# EasyEDA schematic SCH_Solder_2025-04-30.json
TITLE: Sheet_1; REV: 1.0; Date: 2025-04-27; Sheet: 1/1; Drawn By: adarsh2203; Company: Your Company
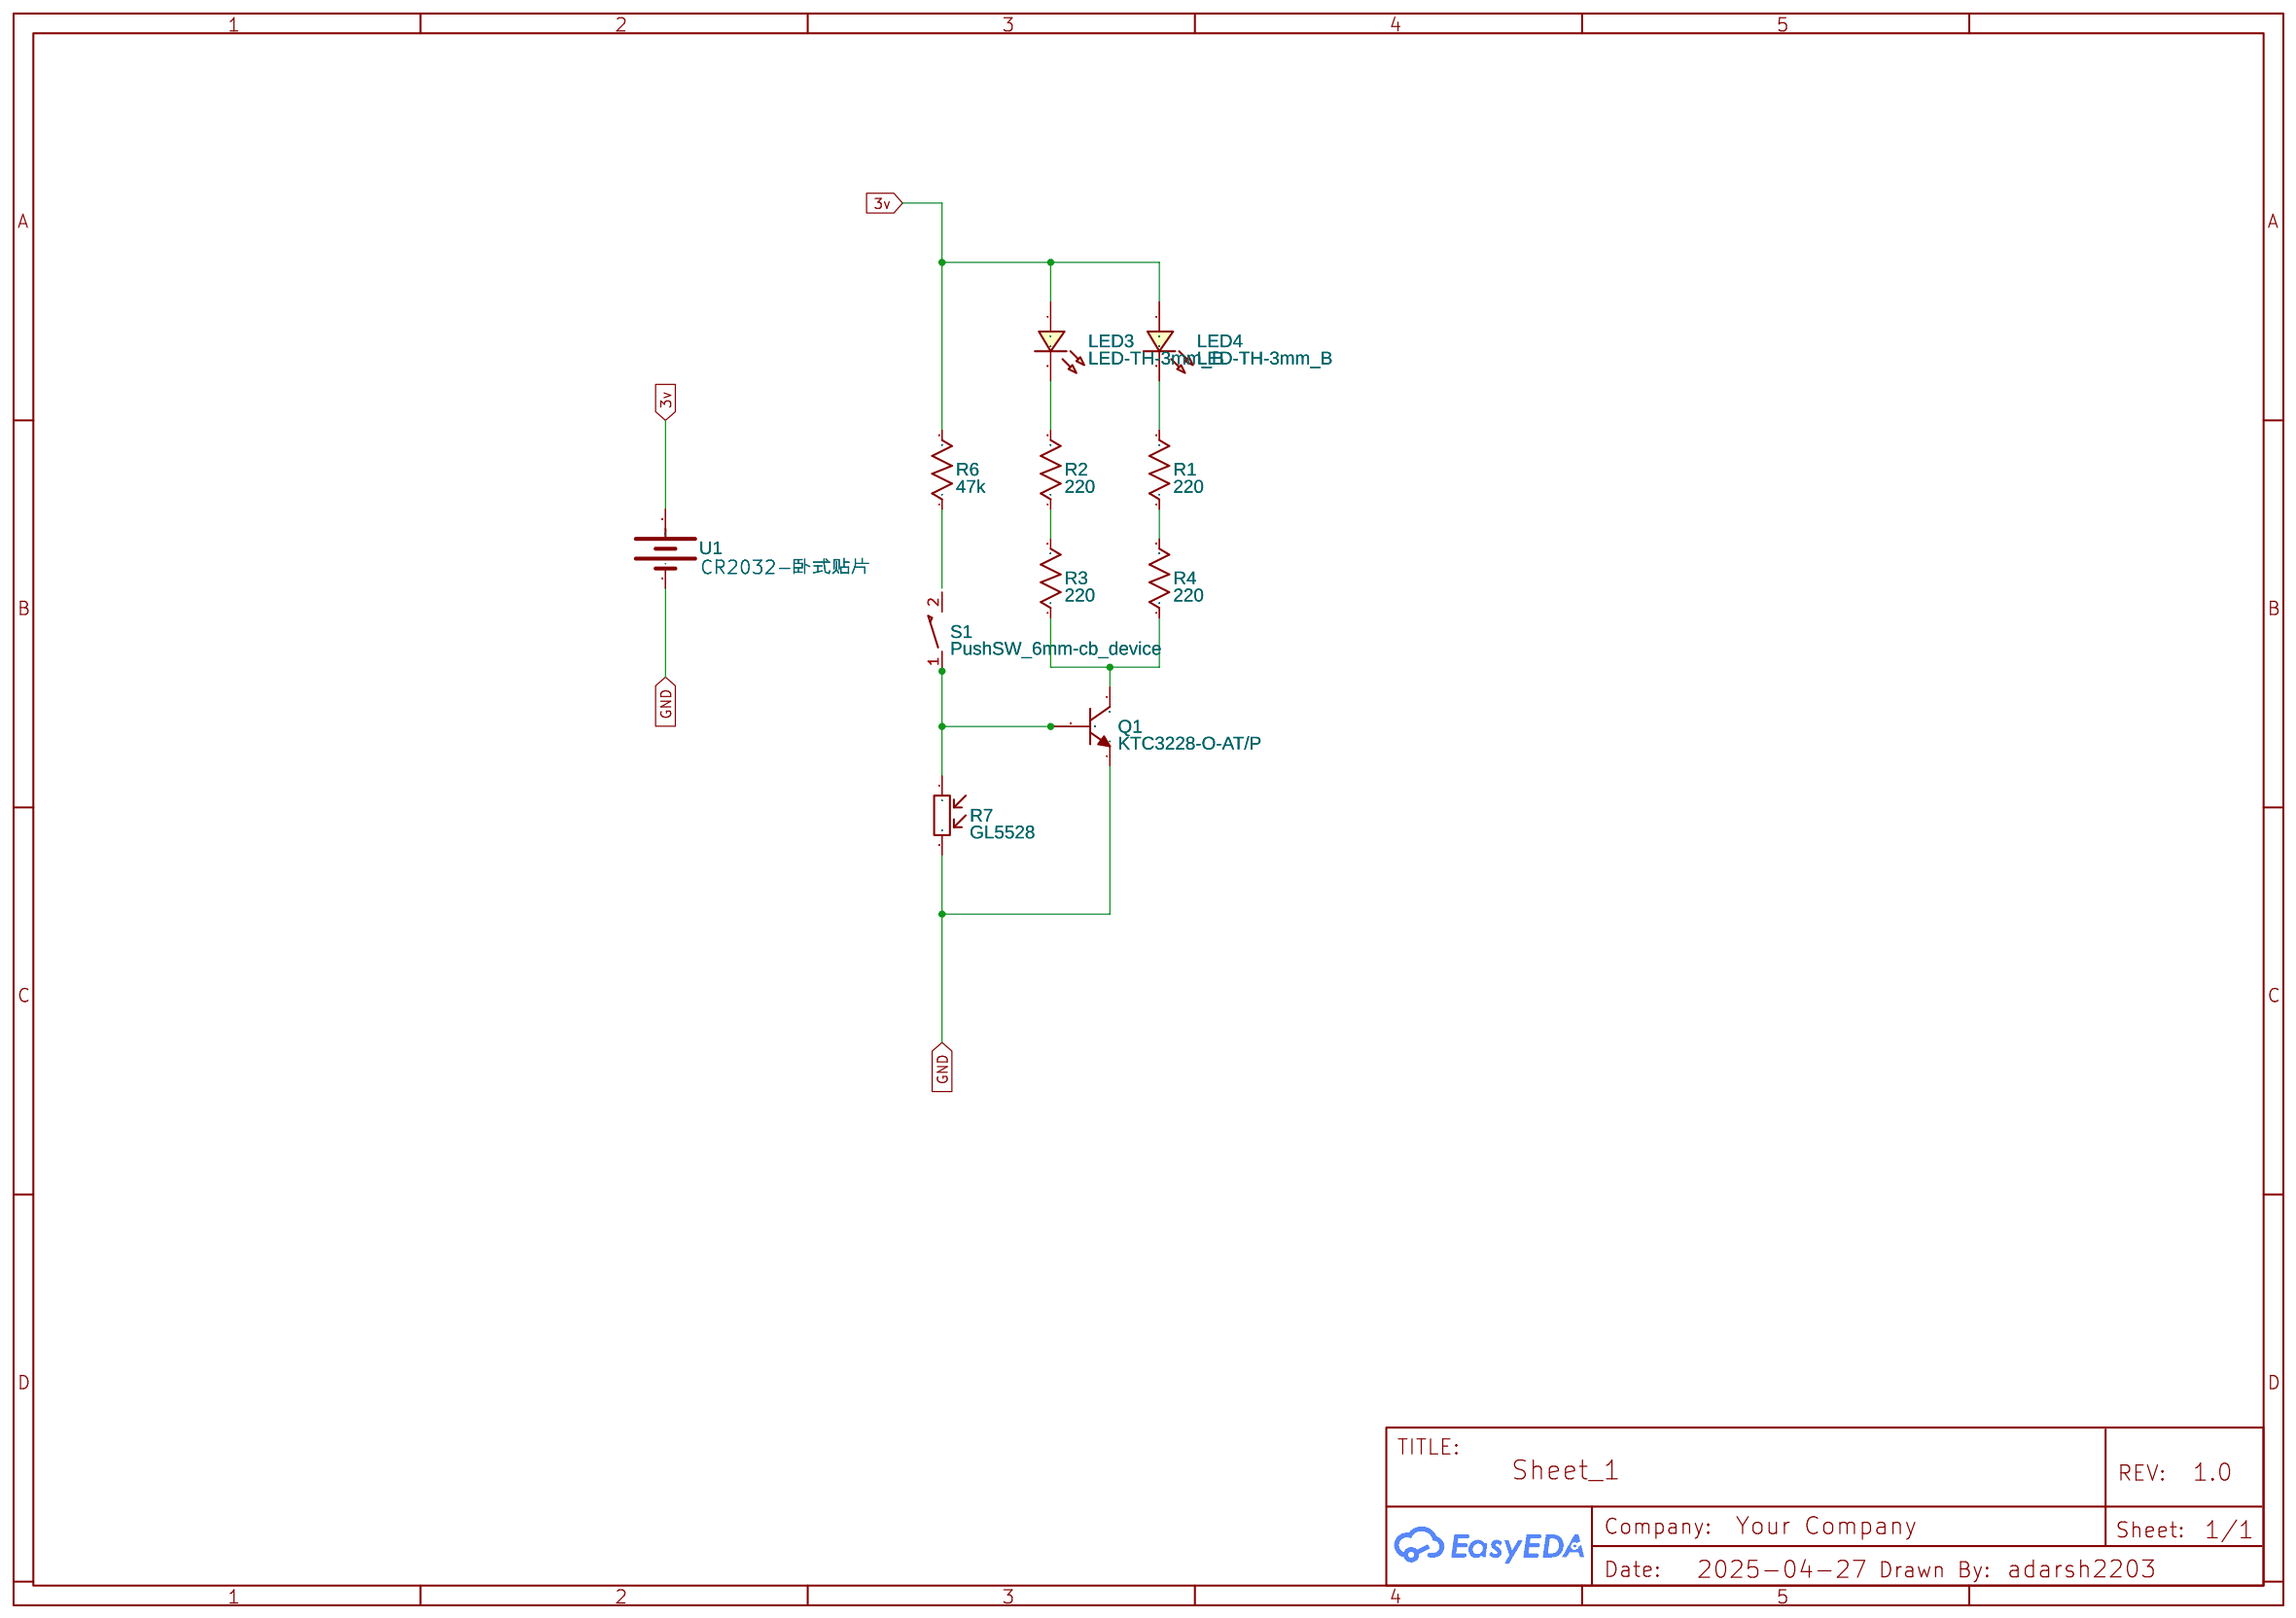
[diagram p0: schematic sheet]

## Parts
LED3  LED-TH-3mm_B  [LED-TH_BD3.0_BLUE]
LED4  LED-TH-3mm_B  [LED-TH_BD3.0_BLUE]
Q1  KTC3228-O-AT/P  [TO-92L-3_L5.2-W2.5-P1.27-L]
R1  220  [R_AXIAL-0.3]
R2  220  [R_AXIAL-0.3]
R3  220  [R_AXIAL-0.3]
R4  220  [R_AXIAL-0.3]
R6  47k  [R_AXIAL-0.3]
R7  GL5528  [RES-TH_L5.1-W4.3-P3.40-D0.5]
S1  PushSW_6mm-cb_device  [SW_PUSH_6MM]
U1  CR2032-卧式贴片  [BAT-SMD_CR2032-C9900005595]

## Library data of the parts
LED3 LED4 = LED-TH-3mm_B: Manufacturer: EVERLIGHT(台湾亿光); Manufacturer Part: 204-10SUBC/S400-A4; Supplier Part: C86881; Supplier: LCSC; Contributor: LCEDA_Lib
Q1 = KTC3228-O-AT/P: Contributor: LCSC; Supplier: LCSC; Manufacturer: KEC; Supplier Part: C125608; JLCPCB Part Class: Extended Part
R1-R4 R6 = R_AXIAL-0.3_US: Contributor: LCEDA_Lib
R7 = GL5528: Supplier: LCSC; Manufacturer: 森霸; Supplier Part: C125627; JLCPCB Part Class: Extended Part
S1 = PushSW_6mm-cb_device: Contributor: Cirbox
U1 = CR2032-卧式贴片: Contributor: LCSC; Supplier: LCSC; Supplier Part: C9900005595; Manufacturer: null; JLCPCB Part Class: Extended Part

## Nets
3v: LED3.1 LED4.1 R6.2 U1.2(+)
GND: Q1.1(E) R7.2 U1.1(-)
Net-(LED3-2): LED3.2 R2.2
Net-(LED4-2): LED4.2 R1.2
Net-(Q1-2): Q1.2(C) R3.1 R4.1
Net-(Q1-3): Q1.3(B) R7.1 S1.1
Net-(R1-1): R1.1 R4.2
Net-(R2-1): R2.1 R3.2

Not connected (* = marked no-connect by the designer): R6 1; S1 2
